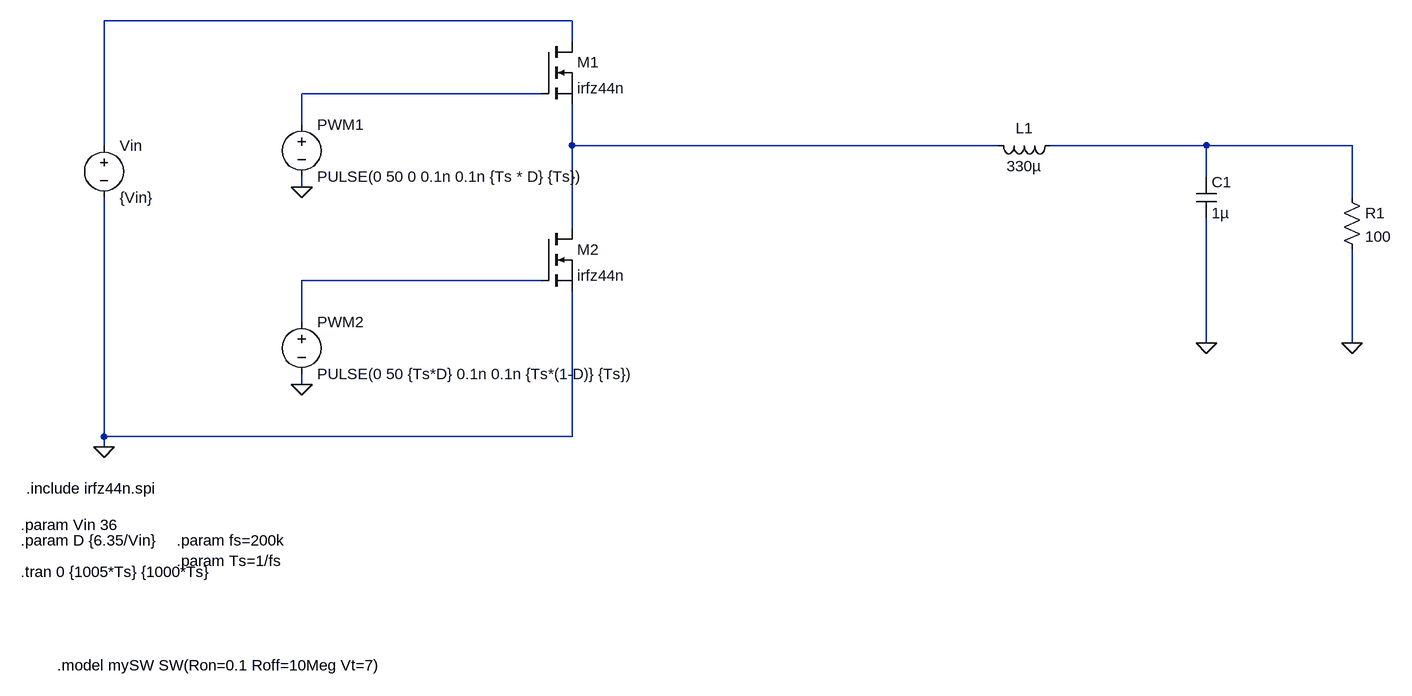
[diagram p0: schematic 04_11_03_buck_simple_con_transistores.asc]
04_11_03_buck_simple_con_transistores.asc, the LTspice schematic file:
Version 4
SHEET 1 1256 1008
WIRE -32 0 -752 0
WIRE -32 32 -32 0
WIRE -80 112 -448 112
WIRE -448 160 -448 112
WIRE -752 192 -752 0
WIRE -32 192 -32 128
WIRE 624 192 -32 192
WIRE 944 192 704 192
WIRE 1168 192 944 192
WIRE 944 240 944 192
WIRE -448 256 -448 240
WIRE 1168 272 1168 192
WIRE -32 320 -32 192
WIRE -80 400 -448 400
WIRE -448 464 -448 400
WIRE 944 496 944 304
WIRE 1168 496 1168 352
WIRE -448 560 -448 544
WIRE -752 640 -752 272
WIRE -32 640 -32 416
WIRE -32 640 -752 640
WIRE -752 656 -752 640
FLAG 944 496 0
FLAG -448 256 0
FLAG -448 560 0
FLAG -752 656 0
FLAG 1168 496 0
SYMBOL ind 720 176 R90
WINDOW 0 5 56 VBottom 2
WINDOW 3 32 56 VTop 2
SYMATTR InstName L1
SYMATTR Value 330µ
SYMBOL cap 928 240 R0
SYMATTR InstName C1
SYMATTR Value 1µ
SYMBOL voltage -752 176 R0
WINDOW 123 0 0 Left 0
WINDOW 39 0 0 Left 0
SYMATTR InstName Vin
SYMATTR Value {Vin}
SYMBOL voltage -448 144 R0
WINDOW 123 0 0 Left 0
WINDOW 39 0 0 Left 0
SYMATTR InstName PWM1
SYMATTR Value PULSE(0 50 0 0.1n 0.1n {Ts * D} {Ts})
SYMBOL voltage -448 448 R0
WINDOW 123 0 0 Left 0
WINDOW 39 0 0 Left 0
SYMATTR InstName PWM2
SYMATTR Value PULSE(0 50 {Ts*D} 0.1n 0.1n {Ts*(1-D)} {Ts})
SYMBOL res 1152 256 R0
SYMATTR InstName R1
SYMATTR Value 100
SYMBOL nmos -80 32 R0
SYMATTR InstName M1
SYMATTR Value irfz44n
SYMBOL nmos -80 320 R0
SYMATTR InstName M2
SYMATTR Value irfz44n
TEXT -640 800 Left 2 !.param fs=200k\n.param Ts=1/fs
TEXT -880 800 Left 2 !.param D {6.35/Vin}
TEXT -880 776 Left 2 !.param Vin 36
TEXT -880 848 Left 2 !.tran 0 {1005*Ts} {1000*Ts}
TEXT -824 992 Left 2 !.model mySW SW(Ron=0.1 Roff=10Meg Vt=7)
TEXT -872 720 Left 2 !.include irfz44n.spi

The netlist it stands for:
* 04_11_03_buck_simple_con_transistores.asc
L1 N004 N003 330µ
C1 N004 0 1µ
Vin N001 0 {Vin}
V§PWM1 N002 0 PULSE(0 50 0 0.1n 0.1n {Ts * D} {Ts})
V§PWM2 N005 0 PULSE(0 50 {Ts*D} 0.1n 0.1n {Ts*(1-D)} {Ts})
R1 N004 0 100
M1 N001 N002 N003 N003 irfz44n
M2 N003 N005 0 0 irfz44n
.model NMOS NMOS
.model PMOS PMOS
.lib standard.mos
.param fs=200k
.param Ts=1/fs
.param D {6.35/Vin}
.param Vin 36
.tran 0 {1005*Ts} {1000*Ts}
.model mySW SW(Ron=0.1 Roff=10Meg Vt=7)
.include irfz44n.spi
.backanno
.end